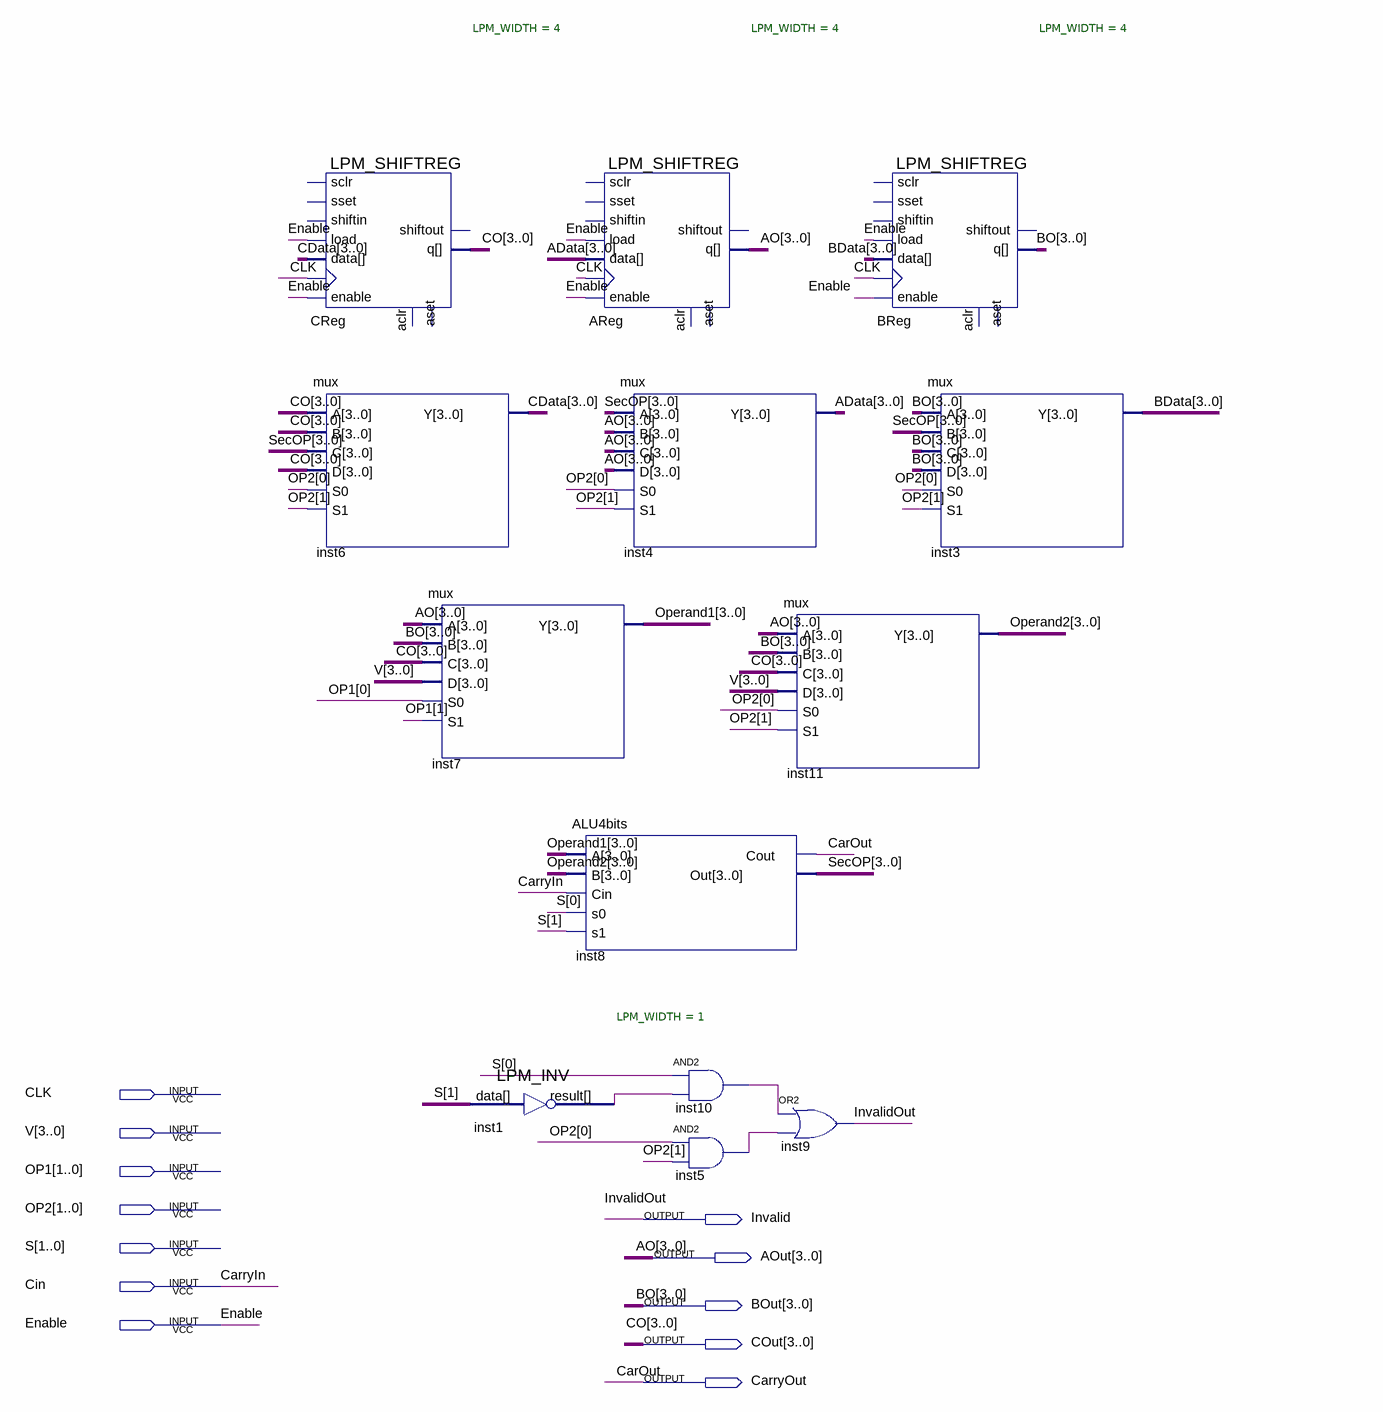
[diagram p0: schematic sheet]
// Quartus schematic ExecutionUnit.bdf as structural Verilog: 13 symbols, 12 pins
module ExecutionUnit (
  input  CLK,
  input  [3:0] V,
  input  [1:0] OP1,
  input  [1:0] OP2,
  input  [1:0] S,
  input  Cin,
  input  Enable,
  output Invalid,
  output [3:0] AOut,
  output [3:0] BOut,
  output [3:0] COut,
  output CarryOut
);

  wire inst1_result, inst5_out, inst10_out;
  wire [3:0] AData, BData, CData, Operand1, Operand2, SecOP;

  LPM_SHIFTREG #(.LPM_WIDTH(4)) CReg (
    .enable(Enable), .clock(CLK), .data(CData), .load(Enable), .q(COut));  // open: shiftin, sset, sclr, aset, aclr, shiftout
  mux inst6 (.A(COut), .B(COut), .C(SecOP), .D(COut), .S0(OP2[0]), .S1(OP2[1]), .Y(CData));
  mux inst7 (.A(AOut), .B(BOut), .C(COut), .D(V), .S0(OP1[0]), .S1(OP1[1]), .Y(Operand1));
  LPM_INV #(.LPM_WIDTH(1)) inst1 (.data(S[1]), .result(inst1_result));
  LPM_SHIFTREG #(.LPM_WIDTH(4)) AReg (
    .enable(Enable), .clock(CLK), .data(AData), .load(Enable), .q(AOut));  // open: shiftin, sset, sclr, aset, aclr, shiftout
  ALU4bits inst8 (.A(Operand1), .B(Operand2), .Cin(Cin), .s0(S[0]), .s1(S[1]), .Cout(CarryOut), .Out(SecOP));
  mux inst4 (.A(SecOP), .B(AOut), .C(AOut), .D(AOut), .S0(OP2[0]), .S1(OP2[1]), .Y(AData));
  and inst10 (inst10_out, S[0], inst1_result);
  and inst5 (inst5_out, OP2[0], OP2[1]);
  mux inst11 (.A(AOut), .B(BOut), .C(COut), .D(V), .S0(OP2[0]), .S1(OP2[1]), .Y(Operand2));
  or inst9 (Invalid, inst10_out, inst5_out);
  LPM_SHIFTREG #(.LPM_WIDTH(4)) BReg (
    .enable(Enable), .clock(CLK), .data(BData), .load(Enable), .q(BOut));  // open: shiftin, sset, sclr, aset, aclr, shiftout
  mux inst3 (.A(BOut), .B(SecOP), .C(BOut), .D(BOut), .S0(OP2[0]), .S1(OP2[1]), .Y(BData));

  // Other names for the same wires on the sheet: AO[3:0] = AOut; BO[3:0] = BOut; CarOut = CarryOut; CarryIn = Cin;
  //   CO[3:0] = COut; InvalidOut = Invalid
endmodule
